# Altium project Mott_Pott.PrjPcb
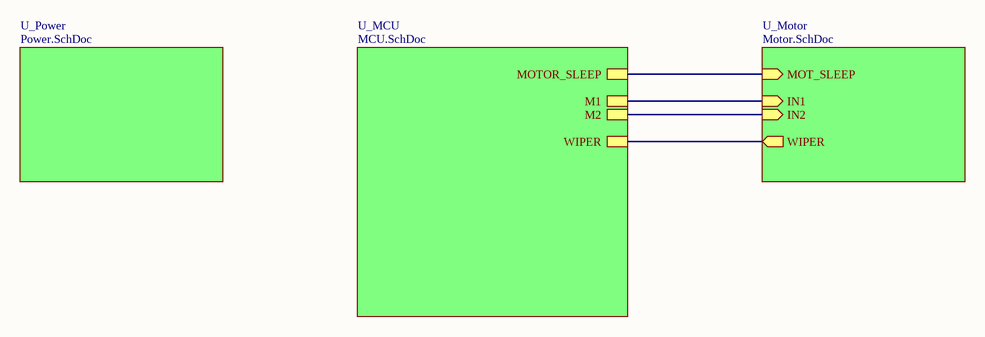
[diagram p0: overview.SchDoc]
4 sheets, 33 parts. Net scope: hierarchical (ports join the sheet entries above them; power ports are global).
Board file: PCB1.PcbDoc
Sheets:
  overview.SchDoc
    U_MCU = MCU.SchDoc
    U_Motor = Motor.SchDoc
    U_Power = Power.SchDoc

## Sheet overview.SchDoc
size A4

### Sub-sheets
U_MCU = MCU.SchDoc: WIPER, M1, M2, MOTOR_SLEEP
U_Motor = Motor.SchDoc: WIPER (out), MOT_SLEEP (in), IN1 (in), IN2 (in)
U_Power = Power.SchDoc: no entries

### Nets
NetB1_13: sheet U_MCU/WIPER, sheet U_Motor/WIPER
NetB1_15: sheet U_MCU/MOTOR_SLEEP, sheet U_Motor/MOT_SLEEP
NetB1_16: sheet U_MCU/M1, sheet U_Motor/IN1
NetB1_18: sheet U_MCU/M2, sheet U_Motor/IN2

## Sheet MCU.SchDoc
size A4
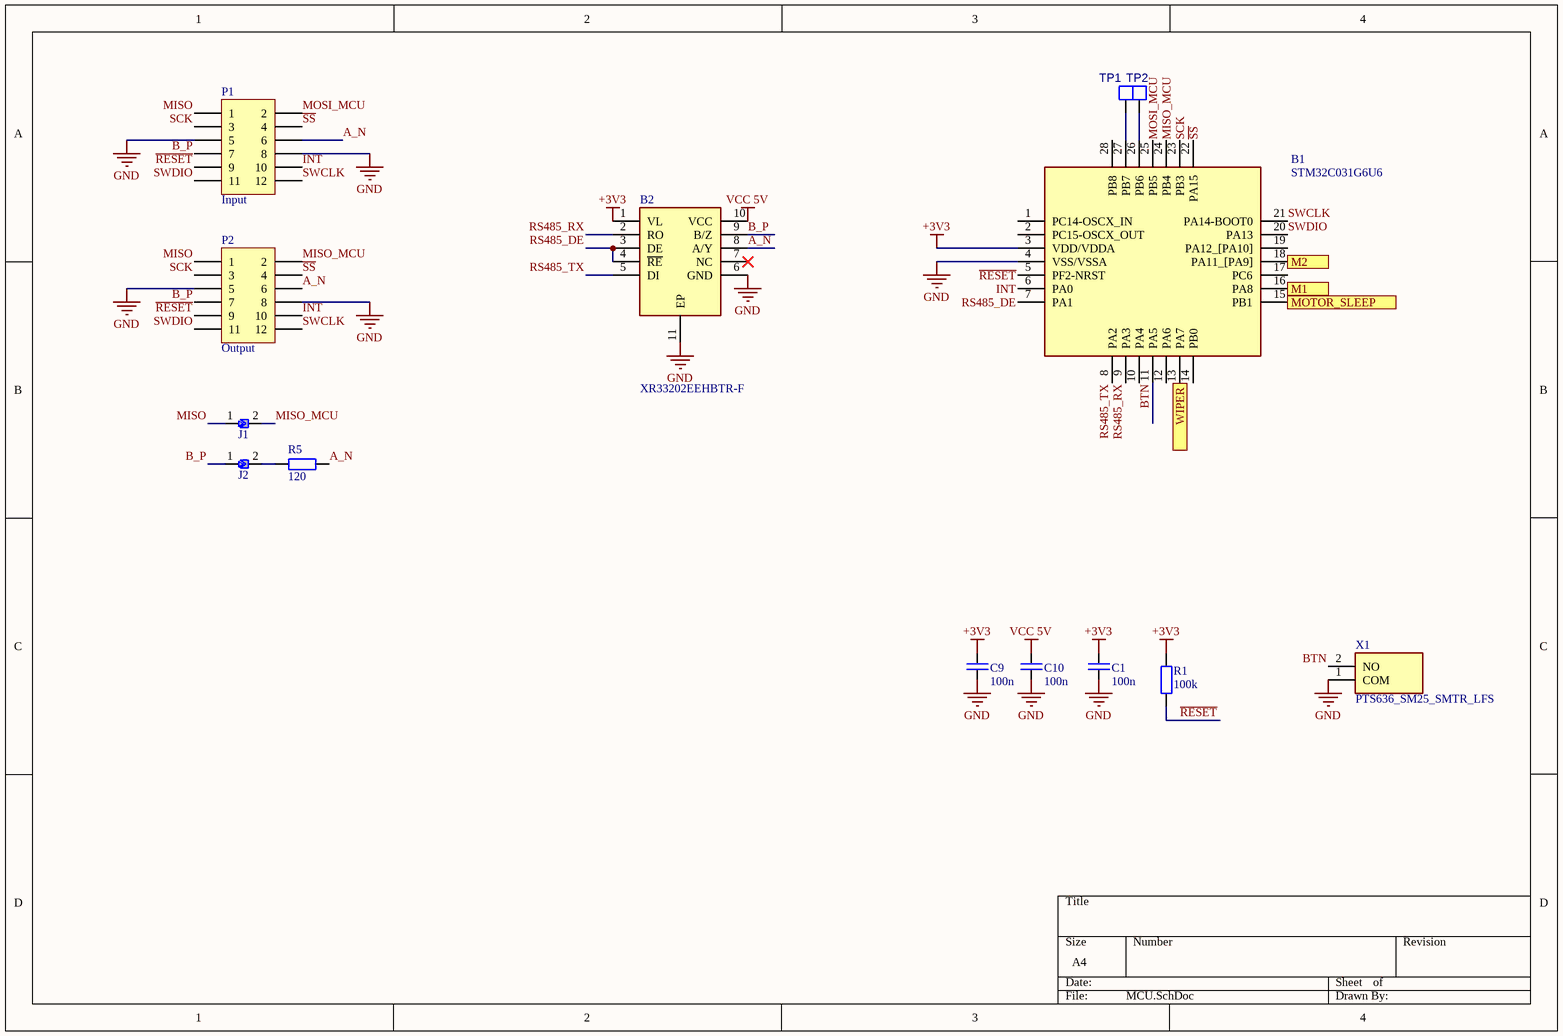
[diagram p1: MCU.SchDoc]

### Parts
B1  STM32C031G6U6  [QFN50P400X400X60-28N-D]
B2  XR33202EEHBTR-F  [SON50P300X300X80-11N-D]
C1  100n  [R1005_0402i_L]
C9  100n  [R1005_0402i_L]
C10  100n  [R1005_0402i_L]
J1  solder_jumper  [solder_jumper_triangle]  (value not drawn)
J2  solder_jumper  [solder_jumper_triangle]  (value not drawn)
P1  Input  [1.27mm SMD conn]
P2  Output  [1.27mm SMD conn]
R1  100k  [R1005_0402i_L]
R5  120  [R1005_0402i_L]
TP1  PAD  [PAD]  (value not drawn)
TP2  PAD  [PAD]  (value not drawn)
X1  PTS636_SM25_SMTR_LFS  [PTS636SM25SMTRLFS]

### Ports
M1, M2, MOTOR_SLEEP, WIPER

### Nets
+3V3: B1.3(VDD/VDDA) B2.1(VL) C1.1 C9.1 R1.1
GND: B1.4(VSS/VSSA) B2.6(GND) B2.11(EP) C1.2 C9.2 C10.2 P1.5 P1.8 P2.5 P2.8 X1.1(COM)
VCC 5V: B2.10(VCC) C10.1
A_N: B2.8(A/Y) P1.6 P2.6 R5.2
B_P: B2.9(B/Z) J2.1 P1.7 P2.7
BTN: B1.11(PA5) X1.2(NO)
INT: B1.6(PA0) P1.10 P2.10
MISO: J1.1 P1.1 P2.1
MISO_MCU: B1.24(PB4) J1.2 P2.2
MOSI_MCU: B1.25(PB5) P1.2
~{RESET}: B1.5(PF2-NRST) P1.9 P2.9 R1.2
RS485_DE: B1.7(PA1) B2.3(DE) B2.4(~{RE})
RS485_RX: B1.9(PA3) B2.2(RO)
RS485_TX: B1.8(PA2) B2.5(DI)
~{SS}: B1.22(PA15) P1.4 P2.4
SCK: B1.23(PB3) P1.3 P2.3
SWCLK: B1.21(PA14-BOOT0) P1.12 P2.12
SWDIO: B1.20(PA13) P1.11 P2.11
NetB1_13: B1.13(PA7) ; port WIPER
NetB1_15: B1.15(PB1) ; port MOTOR_SLEEP
NetB1_16: B1.16(PA8) ; port M1
NetB1_18: B1.18(PA11_[PA9]) ; port M2
NetB1_26: B1.26(PB6) TP2.1
NetB1_27: B1.27(PB7) TP1.1
NetJ2_2: J2.2 R5.1

Not connected (* = marked no-connect by the designer): B1 1(PC14-OSCX_IN) 2(PC15-OSCX_OUT) 10(PA4) 12(PA6) 14(PB0) 17(PC6) 19(PA12_[PA10]) 28(PB8); B2 7(NC)*

### Library data of the parts
B1 = STM32C031G6U6: Mainstream Arm Cortex-M0+ MCU with 32 Kbytes of Flash memory, 12 Kbytes RAM, 48 MHz CPU, 2x USART, timers, ADC, comm. I/F, 2-3.6V; Manufacturer_Name: STMicroelectronics; Geometry.Height: 0.6mm; Mouser Part Number: 511-STM32C031G6U6; Mouser Price/Stock: https://www.mouser.co.uk/ProductDetail/STMicroelectronics/STM32C031G6U6?qs=IPgv5n7u5QZqRf3nOTChhw%3D%3D; Manufacturer_Part_Number: STM32C031G6U6; Datasheet Link: https://www.st.com/resource/en/datasheet/stm32c031c4.pdf
B2 = XR33202EEHBTR-F: RS-422/RS-485 Interface IC Wide Supply Trans with I/O Interface; Manufacturer_Name: MaxLinear, Inc.; Geometry.Height: 0.8mm; Mouser Part Number: 701-XR33202EEHBTR-F; Mouser Price/Stock: https://www.mouser.co.uk/ProductDetail/MaxLinear/XR33202EEHBTR-F?qs=GtWAI9k6EVi4nRW8bj1LFw%3D%3D; Manufacturer_Part_Number: XR33202EEHBTR-F; Datasheet Link: https://www.maxlinear.com/ds/xr33202.pdf
C1 C9 C10 = C: Capacitor
P1 P2 = Header 6X2: Header, 6-Pin, Dual row; LatestRevisionDate: 17-Jul-2002; LatestRevisionNote: Re-released for DXP Platform.; Publisher: Altium Limited
R1 R5 = R
X1 = PTS636_SM25_SMTR_LFS: Tactile Switches Tact 50mA 12VDC, 6.0x3.5, 2.5mm H, 180gf, G leads, No ground pin, White Actuator; Manufacturer_Name: C & K COMPONENTS; Manufacturer_Part_Number: PTS636 SM25 SMTR LFS; Geometry.Height: 2.7mm; Mouser Part Number: 611-PTS636SM25SMTRLF; Mouser Price/Stock: https://www.mouser.co.uk/ProductDetail/CK/PTS636-SM25-SMTR-LFS?qs=vLWxofP3U2yIXR4iooxesw%3D%3D; Datasheet Link: https://componentsearchengine.com/Datasheets/1/PTS636 SM25 SMTR LFS.pdf

## Sheet Motor.SchDoc
size A4
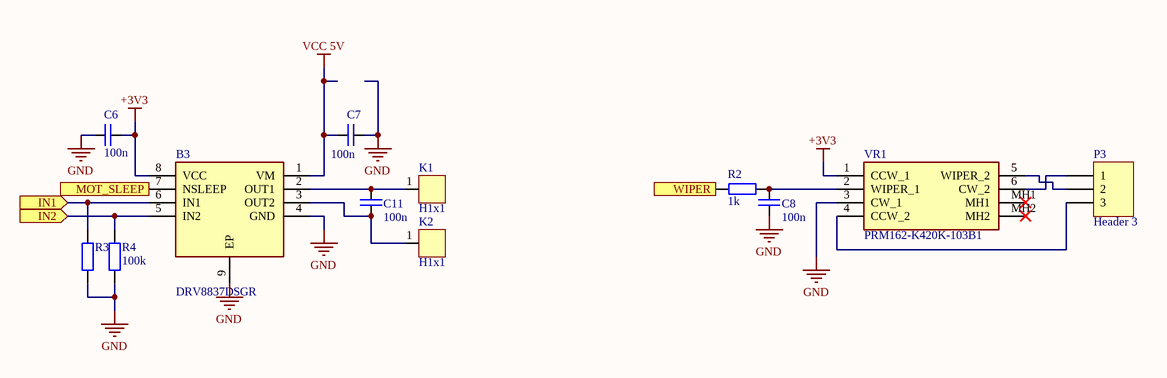
[diagram p2: Motor.SchDoc]

### Parts
B3  DRV8837DSGR  [SON50P200X200X80-9N]
C6  100n  [R1005_0402i_M]
C7  100n  [R1005_0402i_M]
C8  100n  [R1005_0402i_M]
C11  100n  [R1005_0402i_M]
K1  H1x1  [H1x1]
K2  H1x1  [H1x1]
P3  Header 3  [HDR1X3]
R2  1k  [R1005_0402i_L]
R3  100k  [R1005_0402i_L]  (value not drawn)
R4  100k  [R1005_0402i_L]
VR1  PRM162-K420K-103B1  [PRM162K415K103B1]

### Ports
IN1 (in), IN2 (in), MOT_SLEEP (in), WIPER (out)

### Nets
+3V3: B3.8(VCC) C6.2 VR1.1(CCW_1)
GND: B3.4(GND) B3.9(EP) C6.1 C7.2 C8.2 R3.2 R4.2 VR1.3(CW_1)
VCC 5V: B3.1(VM) C7.1
NetB1_13: R2.1 ; port WIPER
NetB1_15: B3.7(NSLEEP) ; port MOT_SLEEP
NetB1_16: B3.6(IN1) R3.1 ; port IN1
NetB1_18: B3.5(IN2) R4.1 ; port IN2
NetB3_2: B3.2(OUT1) C11.2 K1.1
NetB3_3: B3.3(OUT2) C11.1 K2.1
NetC8_1: C8.1 R2.2 VR1.2(WIPER_1)
NetP3_1: P3.1 VR1.6(CW_2)
NetP3_2: P3.2 VR1.5(WIPER_2)
NetP3_3: P3.3 VR1.4(CCW_2)

Not connected (* = marked no-connect by the designer): VR1 MH1* MH2*

### Library data of the parts
B3 = DRV8837DSGR: 1.8A Low Voltage Brushed DC Motor Driver (PWM Ctrl); Manufacturer_Name: Texas Instruments; Geometry.Height: 0.8mm; Mouser Part Number: 595-DRV8837DSGR; Mouser Price/Stock: https://www.mouser.co.uk/ProductDetail/Texas-Instruments/DRV8837DSGR?qs=l6ZoeTYLMwO0pKIJ8222Ww%3D%3D; Manufacturer_Part_Number: DRV8837DSGR; Datasheet Link: http://www.ti.com/lit/gpn/drv8837
C6-C8 C11 = C: Capacitor
K1 K2 = H1x1: Header 1x1 (male)
P3 = Header 3: Header, 3-Pin; LatestRevisionDate: 17-Jul-2002; LatestRevisionNote: Re-released for DXP Platform.; Publisher: Altium Limited
R2-R4 = R
VR1 = PRM162-K420K-103B1: Variable Resistor; Manufacturer_Name: Bourns; Datasheet Link: https://www.bourns.com/docs/product-datasheets/PDB18.pdf; Height: 28.5mm; Manufacturer_Part_Number: PRM162-K420K-103B1; Mouser Part Number: 652-PRM162K420K103B1; Mouser Price/Stock: https://www.mouser.co.uk/ProductDetail/Bourns/PRM162-K420K-103B1?qs=U%2FacTlguYxaZbpiLvzzeCA%3D%3D; Arrow Part Number: PRM162-K420K-103B1; Arrow Price/Stock: https://www.arrow.com/en/products/prm162-k420k-103b1/bourns?region=nac

## Sheet Power.SchDoc
size A4
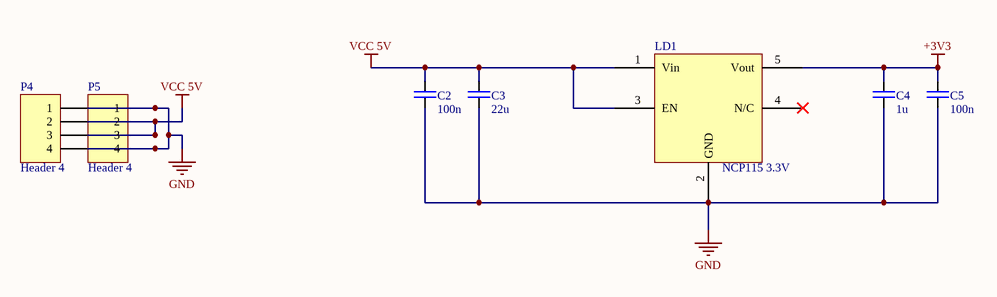
[diagram p3: Power.SchDoc]

### Parts
C2  100n  [R1005_0402i_L]
C3  22u  [C1608_0603I_L]
C4  1u  [R1005_0402i_L]
C5  100n  [R1005_0402i_L]
LD1  NCP115 3.3V  [TSOP95P280X110-6L]
P4  Header 4  [HDR1X4]
P5  Header 4  [HDR1X4]

### Nets
+3V3: C4.1 C5.1 LD1.5(Vout)
GND: C2.2 C3.2 C4.2 C5.2 LD1.2(GND) P4.1 P4.4 P5.1 P5.4
VCC 5V: C2.1 C3.1 LD1.1(Vin) LD1.3(EN) P4.2 P4.3 P5.2 P5.3

Not connected (* = marked no-connect by the designer): LD1 4(N/C)*

### Library data of the parts
C2-C5 = C: Capacitor
P4 P5 = Header 4: Header, 4-Pin; LatestRevisionDate: 17-Jul-2002; LatestRevisionNote: Re-released for DXP Platform.; Publisher: Altium Limited

## Nets that join several sheets
+3V3: MCU (5 pins), Motor (B3.8 C6.2 VR1.1), Power (C4.1 C5.1 LD1.5)
GND: MCU (11 pins), Motor (8 pins), Power (9 pins)
VCC 5V: MCU (B2.10 C10.1), Motor (B3.1 C7.1), Power (8 pins)
NetB1_13: MCU (B1.13), Motor (R2.1)
NetB1_15: MCU (B1.15), Motor (B3.7)
NetB1_16: MCU (B1.16), Motor (B3.6 R3.1)
NetB1_18: MCU (B1.18), Motor (B3.5 R4.1)